# EAGLE design white_line (EAGLE 9.4.2)
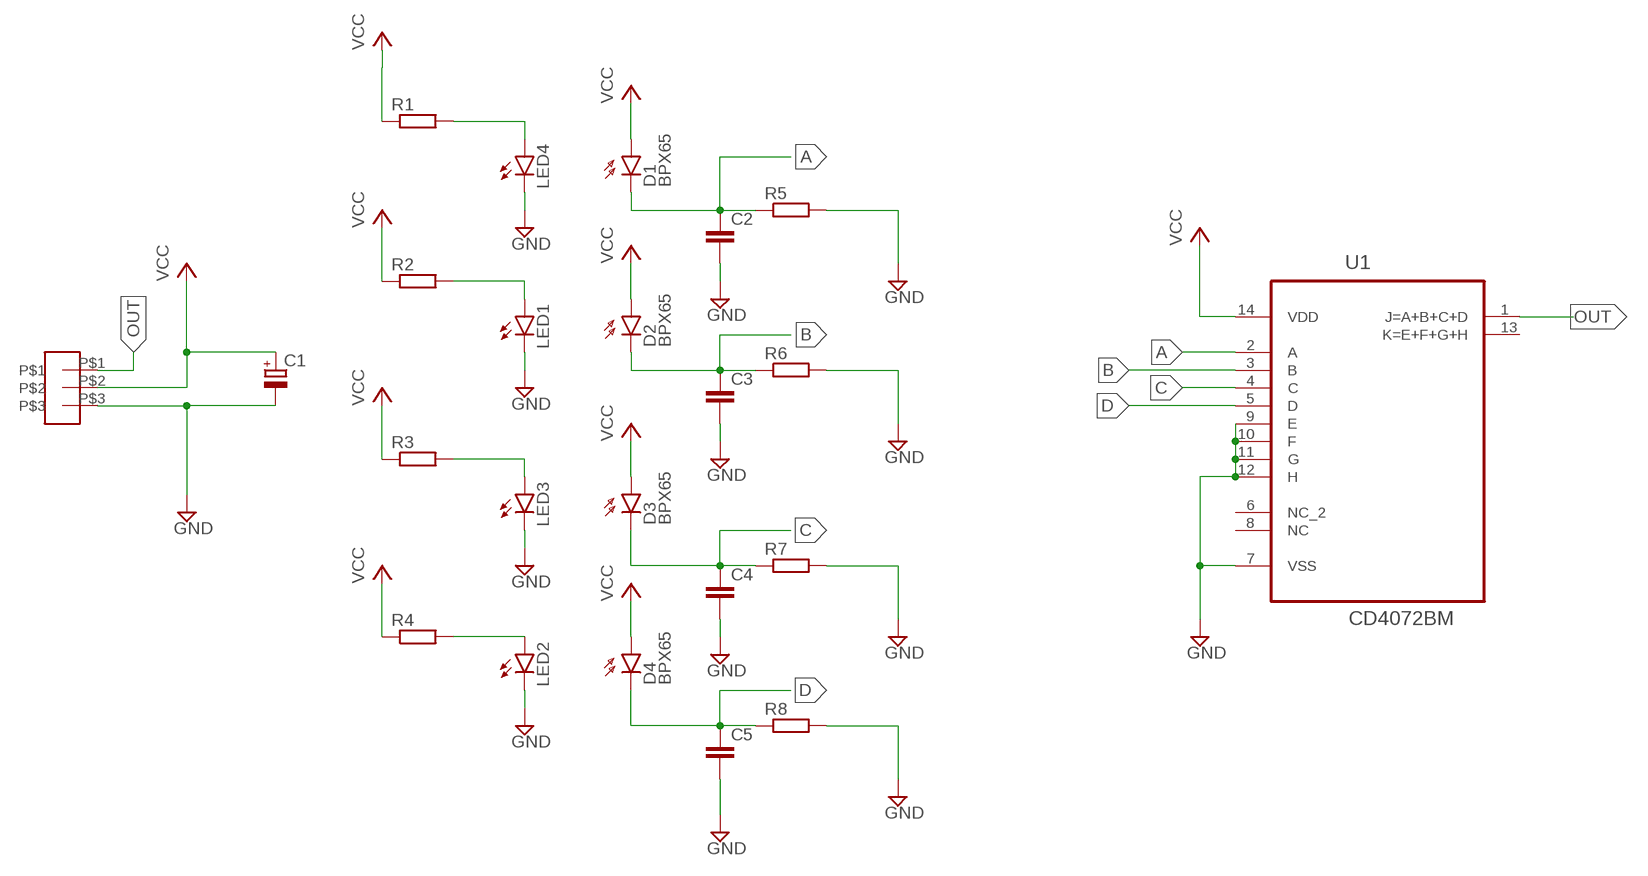
[diagram p0: schematic, sheet 1]

## Parts
3PIN2  3PIN  [3PIN]
C1  CPOL-EUE2-5  [E2-5]
C2  C-EU050-024X044  [C050-024X044]
C3  C-EU050-024X044  [C050-024X044]
C4  C-EU050-024X044  [C050-024X044]
C5  C-EU050-024X044  [C050-024X044]
D1  BPX65  [BPX65]
D2  BPX65  [BPX65]
D3  BPX65  [BPX65]
D4  BPX65  [BPX65]
LED1  LED3MM  [LED3MM]
LED2  LED3MM  [LED3MM]
LED3  LED3MM  [LED3MM]
LED4  LED3MM  [LED3MM]
R1  R-EU_0204/7  [0204/7]
R2  R-EU_0204/7  [0204/7]
R3  R-EU_0204/7  [0204/7]
R4  R-EU_0204/7  [0204/7]
R5  R-EU_0204/7  [0204/7]
R6  R-EU_0204/7  [0204/7]
R7  R-EU_0204/7  [0204/7]
R8  R-EU_0204/7  [0204/7]
U1  CD4072BM  [SOIC127P600X175-14N]

## Nets
A: C2.1 D1.K(C) R5.1 U1.2(A)
B: C3.1 D2.K(C) R6.1 U1.3(B)
C: C4.1 D3.K(C) R7.1 U1.4(C)
D: C5.1 D4.K(C) R8.1 U1.5(D)
GND: 3PIN2.P$3 C1.- C2.2 C3.2 C4.2 C5.2 LED1.K(C) LED2.K(C) LED3.K(C) LED4.K(C) R5.2 R6.2 R7.2 R8.2 U1.7(VSS) U1.9(E) U1.10(F) U1.11(G) U1.12(H)
N$1: LED4.A R1.2
N$2: LED1.A R2.2
N$3: LED3.A R3.2
N$4: LED2.A R4.2
OUT: 3PIN2.P$1 U1.1(J=A+B+C+D)
VCC: 3PIN2.P$2 C1.+ D1.A D2.A D3.A D4.A R1.1 R2.1 R3.1 R4.1 U1.14(VDD)
Unconnected: U1.6(NC_2) U1.8(NC) U1.13(K=E+F+G+H)

## Library data of the parts
3PIN2 = 3PIN_2:3PIN
C1 = rcl:CPOL-EU: POLARIZED CAPACITOR, European symbol; SPICEPREFIX: C
C2-C5 = rcl:C-EU: CAPACITOR, European symbol; SPICEPREFIX: C
D1-D4 = opto-trans-siemens:BPX65: PHOTO DIODE; MPN: BPX65.; OC_FARNELL: 327451; OC_NEWARK: 06WX2764
LED1-LED4 = led:LED: LED OSRAM: - CHIPLED LG R971, LG N971, LY N971, LG Q971, LY Q971, LO R971, LY R971 LH N974, LH R974 LS Q976, LO Q976, LY Q976 LO Q996 - Hyper CHIPLED LW Q18S LB Q993, LB Q99A, LB R99A - SideLED LS A670, LO A670, LY A670, LG A670, LP A670 LB A673, LV A673, LT A673, LW A673 LH A674 LY A675 LS A676, LA A676, LO A676, LY A676, LW A676 LS A679, LY A679, LG A679 - Hyper Micro SIDELED® LS Y876, LA Y876, LO Y876, LY Y876 LT Y87S - SmartLED LW L88C, LW L88S LB L89C, LB L89S, LG L890 LS L89K, LO L89K, LY L89K LS L896, LA L896, LO L896, LY L896 - TOPLED LS T670, LO T670, LY T670, LG T670, LP T670 LSG T670, LSP T670, LSY T670, LOP T670, LYG T670 LG T671, LOG T671, LSG T671 LB T673, LV T673, LT T673, LW T673 LH T674 LS T676, LA T676, LO T676, LY T676, LB T676, LH T676, LSB T676, LW T676 LB T67C, LV T67C, LT T67C, LS T67K, LO T67K, LY T67K, LW E67C LS E67B, LA E67B, LO E67B, LY E67B, LB E67C, LV E67C, LT E67C LW T67C LS T679, LY T679, LG T679 LS T770, LO T770, LY T770, LG T770, LP T770 LB T773, LV T773, LT T773, LW T773 LH T774 LS E675, LA E675, LY E675, LS T675 LS T776, LA T776, LO T776, LY T776, LB T776 LHGB T686 LT T68C, LB T68C - Hyper Mini TOPLED® LB M676 - Mini TOPLED Santana® LG M470 LS M47K, LO M47K, LY M47K Source: http://www.osram.convergy.de LUXEON: - LUMILED® LXK2-PW12-R00, LXK2-PW12-S00, LXK2-PW14-U00, LXK2-PW14-V00 LXK2-PM12-R00, LXK2-PM12-S00, LXK2-PM14-U00 LXK2-PE12-Q00, LXK2-PE12-R00, LXK2-PE12-S00, LXK2-PE14-T00, LXK2-PE14-U00 LXK2-PB12-K00, LXK2-PB12-L00, LXK2-PB12-M00, LXK2-PB14-N00, LXK2-PB14-P00, LXK2-PB14-Q00 LXK2-PR12-L00, LXK2-PR12-M00, LXK2-PR14-Q00, LXK2-PR14-R00 LXK2-PD12-Q00, LXK2-PD12-R00, LXK2-PD12-S00 LXK2-PH12-R00, LXK2-PH12-S00 LXK2-PL12-P00, LXK2-PL12-Q00, LXK2-PL12-R00 Source: www.luxeon.com KINGBRIGHT: KA-3528ASYC Source: www.kingbright.com
R1-R8 = rcl:R-EU_: RESISTOR, European symbol; SPICEPREFIX: R
U1 = CD4072BM:CD4072BM: CMOS OR Gates; AVAILABILITY: Unavailable; DESCRIPTION: CMOS Dual 4-Input OR Gate 14-SOIC -55 to 125; MF: Texas Instruments; MP: CD4072BM; PACKAGE: SOIC-14 Texas Instruments; PRICE: None

## Board
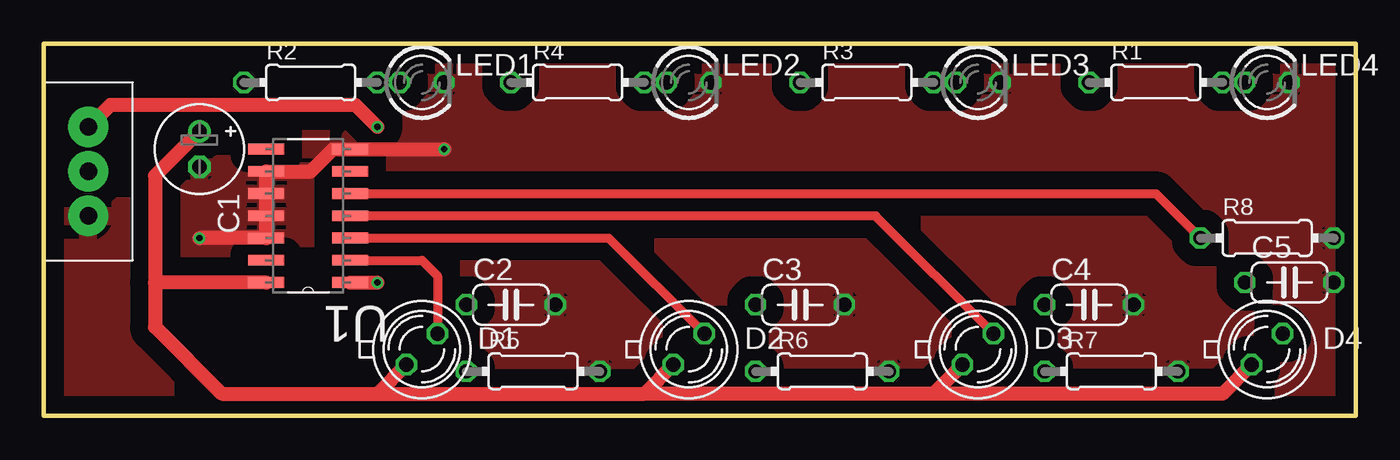
[diagram p1: board, top side]
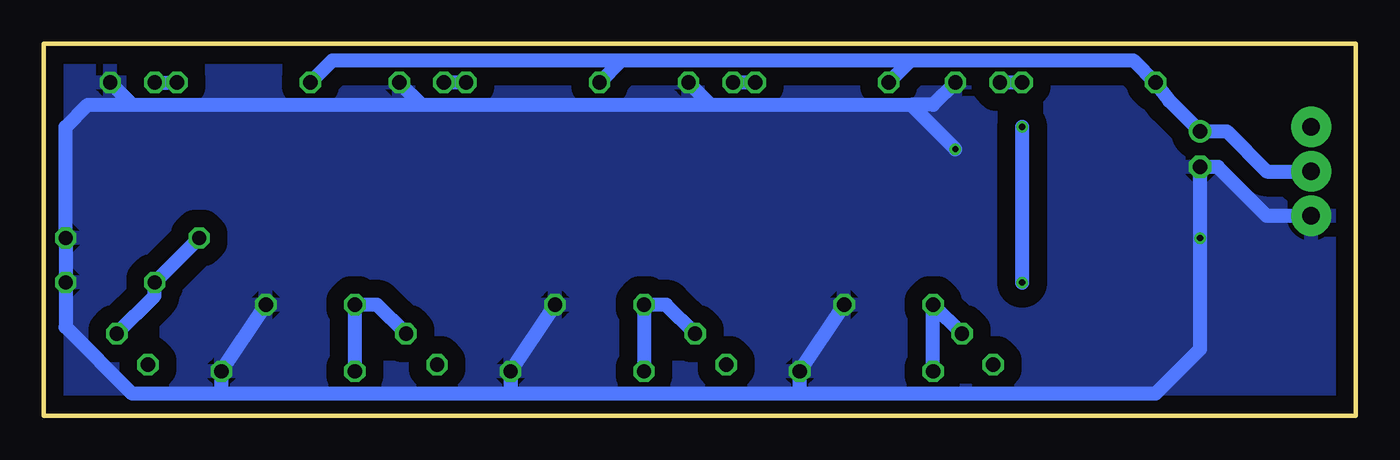
[diagram p2: board, bottom side, seen from below]

Size 74.91 x 21.26 mm. Coordinates in mm from the lower left corner, seen from the top.
Outline: 0,0 74.91,0 74.91,21.26 0,21.26 0,0
Copper layers (1*16): Top 0.035mm / dielectric 1.6mm / Bottom 0.035mm
Design rules "Elecrow_2-layer_PCB_eagle_rule": minimum track width 6mil, minimum drill 12mil, track to track 6mil, track to pad 6mil, pad to pad 6mil, via to via 8mil, smd to smd 0mil, copper to edge 20mil, drill to drill 10mil, minimum pad ring 6mil, minimum via ring 6mil, stop-mask expansion 0mil, vias tented up to drill 100mil, thermal gap 10mil

### Footprints (pad centres in the part's own frame; a part is rotated, then mirrored left to right if it is on the bottom)
3PIN = drill 1 pad 2.3: P$1 0,0; P$2 2.54,0; P$3 5.08,0
E2-5 = drill 0.813 pad 1.27: + -1.016,0 | drill 0.813 pad 1.27 octagon: - 1.016,0
C050-024X044 = drill 0.813 octagon: 1 -2.54,0; 2 2.54,0
BPX65 = drill 0.813 octagon: A -0.889,-0.889; K 0.889,0.889
LED3MM = drill 0.813 octagon: A -1.27,0; K 1.27,0
0204/7 = drill 0.813 octagon: 1 -3.81,0; 2 3.81,0
SOIC127P600X175-14N = smd 2.057 x 0.61: 1 -4.801,7.62; 2 -4.801,6.35; 3 -4.801,5.08; 4 -4.801,3.81; 5 -4.801,2.54; 6 -4.801,1.27; 7 -4.801,0; 8 0,0; 9 0,1.27; 10 0,2.54; 11 0,3.81; 12 0,5.08; 13 0,6.35; 14 0,7.62

### Placement (x,y rotation side)
3PIN2  2.54,16.51 270 top
C1  8.89,15.24 270 top
C2  26.67,6.35 0 top
C3  43.18,6.35 0 top
C4  59.69,6.35 0 top
C5  71.12,7.62 0 top
D1  21.59,3.81 0 top
D2  36.83,3.81 0 top
D3  53.34,3.81 0 top
D4  69.85,3.81 0 top
LED1  21.59,19.05 0 top
LED2  36.83,19.05 0 top
LED3  53.34,19.05 0 top
LED4  69.85,19.05 0 top
R1  63.5,19.05 0 top
R2  15.24,19.05 0 top
R3  46.99,19.05 0 top
R4  30.48,19.05 0 top
R5  27.94,2.54 0 top
R6  44.45,2.54 0 top
R7  60.96,2.54 0 top
R8  69.85,10.16 0 top
U1  12.7,15.24 180 top

### Tracks (layer width: path | path; a pad name or v marks a point on that pad's centre or on a via)
A
  Top 0.508: U1.2 21.59,8.89 22.48,8 D1.K
  Bottom 0.813: D1.K C2.1 R5.1
B
  Top 0.508: D2.K 32.26,10.16 U1.3
  Bottom 0.813: R6.1 C3.1 39.37,6.35 D2.K
C
  Top 0.508: D3.K 47.5,11.43 U1.4
  Bottom 0.813: R7.1 C4.1 55.88,6.35 D3.K
D
  Top 0.508: R8.1 63.5,12.7 U1.5
  Bottom 0.813: D4.K 68.58,6.86 C5.1 R8.1
GND  (via drill 0.35)
  Top 0.813: v8.89,10.16 U1.12 U1.11 U1.10 U1.9 15.24,13.97 16.51,15.24 U1.7 v22.86,15.24
  Bottom 0.813: LED4.K 69.85,17.78 | 69.85,17.78 53.34,17.78 | 53.34,17.78 36.83,17.78 | 36.83,17.78 25.4,17.78 | LED2.K 36.83,17.78 | LED3.K 53.34,17.78 | 3PIN2.P$3 5.08,11.43 7.87,14.22 C1.- v8.89,10.16 8.89,3.81 11.43,1.27 31.75,1.27 | C4.2 R7.2 64.77,1.27 | C3.2 R6.2 48.26,1.27 | v22.86,15.24 25.4,17.78 | LED1.K 24.13,17.78 25.4,17.78 | 31.75,1.27 48.26,1.27 | 48.26,1.27 64.77,1.27 | 64.77,1.27 69.85,1.27 73.66,5.08 C5.2 R8.2 73.66,16.51 72.39,17.78 69.85,17.78 | C2.2 R5.2 31.75,1.27
  pour Top (isolate 1.016): 0,21.59 74.93,21.59 74.93,0 0,0
  pour Bottom (isolate 1.016): 0,21.59 0,0 74.93,0 74.93,21.59
N$1
  Bottom 0.813: LED4.A R1.2
N$2
  Bottom 0.813: R2.2 LED1.A
N$3
  Bottom 0.813: R3.2 LED3.A
N$4
  Bottom 0.813: R4.2 LED2.A
OUT  (via drill 0.35)
  Top 0.813: 3PIN2.P$1 3.81,17.78 17.78,17.78 v19.05,16.51 | U1.1 v19.05,7.62
  Bottom 0.813: v19.05,16.51 v19.05,7.62
VCC
  Top 0.813: D4.A 67.31,1.27 50.8,1.27 | 50.8,1.27 34.29,1.27 | D3.A 50.8,1.27 | D2.A 34.29,1.27 | D1.A 19.05,1.27 | 6.35,7.62 6.35,5.08 10.16,1.27 19.05,1.27 | U1.14 6.35,7.62 | C1.+ 6.35,13.72 6.35,7.62 | 19.05,1.27 34.29,1.27
  Bottom 0.813: R1.1 58.42,20.32 41.91,20.32 | 41.91,20.32 25.4,20.32 | 25.4,20.32 12.7,20.32 R2.1 10.64,18.01 C1.+ 7.37,16.26 5.08,13.97 3PIN2.P$2 | R4.1 25.4,20.32 | R3.1 41.91,20.32